# Altium schematic sheet Power_v1.SchDoc
size Legal
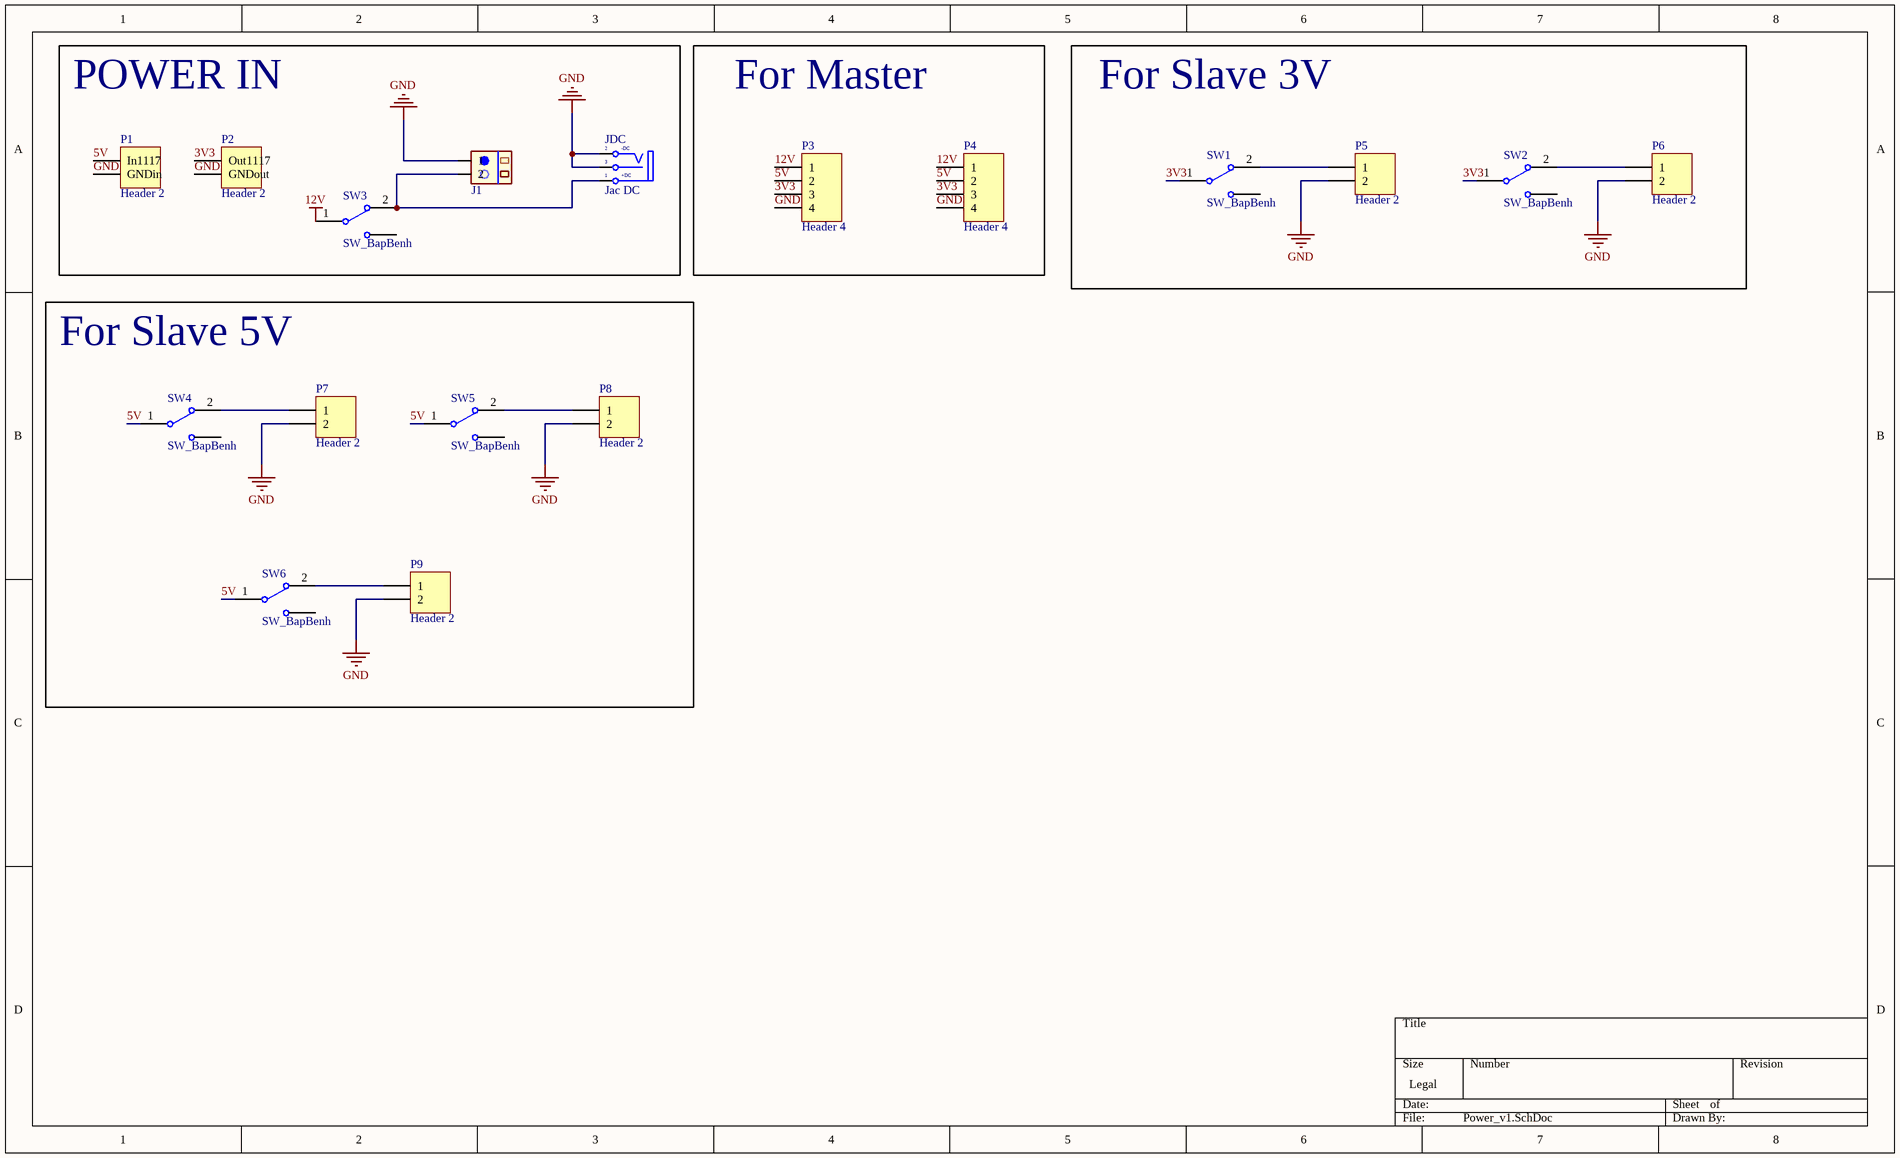
[diagram p0: Power_v1.SchDoc]

## Parts
J1  CON.Domino2  [Domino 2M]  (value not drawn)
JDC  Jac DC  [DC-IN]
P1  Header 2  [HDR1X2]
P2  Header 2  [HDR1X2]
P3  Header 4  [Header 4]
P4  Header 4  [Header 4]
P5  Header 2  [Header 2]
P6  Header 2  [Header 2]
P7  Header 2  [Header 2]
P8  Header 2  [Header 2]
P9  Header 2  [Header 2]
SW1  SW_BapBenh  [SW_Bapbenh]
SW2  SW_BapBenh  [SW_Bapbenh]
SW3  SW_BapBenh  [SW_Bapbenh]
SW4  SW_BapBenh  [SW_Bapbenh]
SW5  SW_BapBenh  [SW_Bapbenh]
SW6  SW_BapBenh  [SW_Bapbenh]

## Blocks framed on the sheet
POWER IN: J1 JDC P1 P2 SW3
For Master: P3 P4
For Slave 3V: P5 P6 SW1 SW2
For Slave 5V: P7-P9 SW4-SW6

## Nets
12V: P3.1 P4.1 SW3.1
GND: J1.1 JDC.2(TN) JDC.3(S) P1.2(GNDin) P2.2(GNDout) P3.4 P4.4 P5.2 P6.2 P7.2 P8.2 P9.2
3V3: P2.1(Out1117) P3.3 P4.3 SW1.1 SW2.1
5V: P1.1(In1117) P3.2 P4.2 SW4.1 SW5.1 SW6.1
NetJ1_2: J1.2 JDC.1(T) SW3.2
NetP5_1: P5.1 SW1.2
NetP6_1: P6.1 SW2.2
NetP7_1: P7.1 SW4.2
NetP8_1: P8.1 SW5.2
NetP9_1: P9.1 SW6.2

## Notes on the sheet
- (in symbol DCIN) -DC; +DC

## Library data of the parts
J1 = CON.Domino2: 2 pins Domino Header; Publisher: Hoang Nguyen; ComponentLink1Description: Digikey Part link; ComponentLink2Description: Open DataSheet; ComponentLink2URL: H:\LIBRARY\LIBRARY.Datasheet\; Price: 2000VND
JDC = DCIN: Jac DC input; Value: Jac DC
P1 P2 P5-P9 = Header 2: Header, 2-Pin; LatestRevisionDate: 17-Jul-2002; LatestRevisionNote: Re-released for DXP Platform.; Publisher: Altium Limited
P3 P4 = Header 4: Header, 4-Pin; LatestRevisionDate: 17-Jul-2002; LatestRevisionNote: Re-released for DXP Platform.; Publisher: Altium Limited